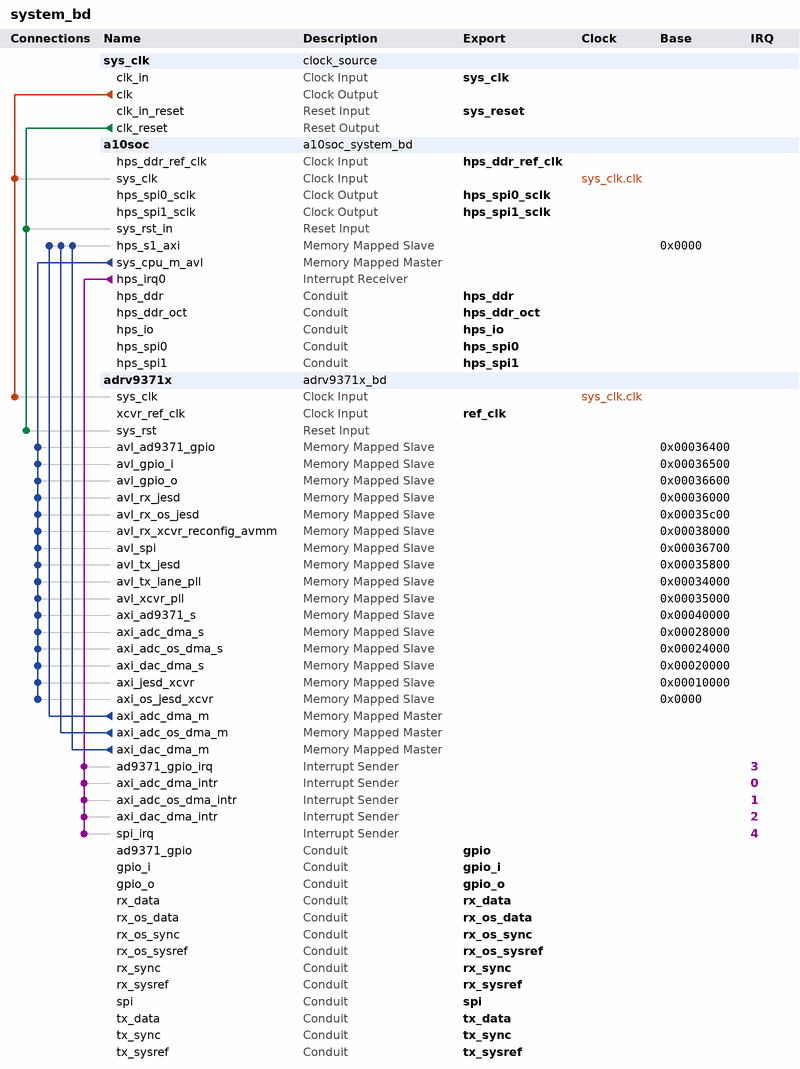
[diagram p0: system contents]
# Platform Designer (Qsys) system system_bd, Arria 10 10AS066N3F40E2SGE2
# Parameters at their usual value, and those the tool derives, are not listed.
package require -exact qsys 15.1
create_system system_bd
set_project_property DEVICE_FAMILY {Arria 10}
set_project_property DEVICE 10AS066N3F40E2SGE2

add_instance sys_clk clock_source 15.1
set_instance_parameter_value sys_clk clockFrequency 100000000

add_instance a10soc a10soc_system_bd 1.0

add_instance adrv9371x adrv9371x_bd 1.0

# connections
add_connection sys_clk.clk a10soc.sys_clk clock
add_connection sys_clk.clk adrv9371x.sys_clk clock
add_connection sys_clk.clk_reset a10soc.sys_rst_in reset
add_connection sys_clk.clk_reset adrv9371x.sys_rst reset
add_connection a10soc.sys_cpu_m_avl adrv9371x.avl_ad9371_gpio avalon
set_connection_parameter_value a10soc.sys_cpu_m_avl/adrv9371x.avl_ad9371_gpio baseAddress 0x00036400
add_connection a10soc.sys_cpu_m_avl adrv9371x.avl_gpio_i avalon
set_connection_parameter_value a10soc.sys_cpu_m_avl/adrv9371x.avl_gpio_i baseAddress 0x00036500
add_connection a10soc.sys_cpu_m_avl adrv9371x.avl_gpio_o avalon
set_connection_parameter_value a10soc.sys_cpu_m_avl/adrv9371x.avl_gpio_o baseAddress 0x00036600
add_connection a10soc.sys_cpu_m_avl adrv9371x.avl_rx_jesd avalon
set_connection_parameter_value a10soc.sys_cpu_m_avl/adrv9371x.avl_rx_jesd baseAddress 0x00036000
add_connection a10soc.sys_cpu_m_avl adrv9371x.avl_rx_os_jesd avalon
set_connection_parameter_value a10soc.sys_cpu_m_avl/adrv9371x.avl_rx_os_jesd baseAddress 0x00035c00
add_connection a10soc.sys_cpu_m_avl adrv9371x.avl_rx_xcvr_reconfig_avmm avalon
set_connection_parameter_value a10soc.sys_cpu_m_avl/adrv9371x.avl_rx_xcvr_reconfig_avmm baseAddress 0x00038000
add_connection a10soc.sys_cpu_m_avl adrv9371x.avl_spi avalon
set_connection_parameter_value a10soc.sys_cpu_m_avl/adrv9371x.avl_spi baseAddress 0x00036700
add_connection a10soc.sys_cpu_m_avl adrv9371x.avl_tx_jesd avalon
set_connection_parameter_value a10soc.sys_cpu_m_avl/adrv9371x.avl_tx_jesd baseAddress 0x00035800
add_connection a10soc.sys_cpu_m_avl adrv9371x.avl_tx_lane_pll avalon
set_connection_parameter_value a10soc.sys_cpu_m_avl/adrv9371x.avl_tx_lane_pll baseAddress 0x00034000
add_connection a10soc.sys_cpu_m_avl adrv9371x.avl_xcvr_pll avalon
set_connection_parameter_value a10soc.sys_cpu_m_avl/adrv9371x.avl_xcvr_pll baseAddress 0x00035000
add_connection a10soc.sys_cpu_m_avl adrv9371x.axi_ad9371_s avalon
set_connection_parameter_value a10soc.sys_cpu_m_avl/adrv9371x.axi_ad9371_s baseAddress 0x00040000
add_connection a10soc.sys_cpu_m_avl adrv9371x.axi_adc_dma_s avalon
set_connection_parameter_value a10soc.sys_cpu_m_avl/adrv9371x.axi_adc_dma_s baseAddress 0x00028000
add_connection a10soc.sys_cpu_m_avl adrv9371x.axi_adc_os_dma_s avalon
set_connection_parameter_value a10soc.sys_cpu_m_avl/adrv9371x.axi_adc_os_dma_s baseAddress 0x00024000
add_connection a10soc.sys_cpu_m_avl adrv9371x.axi_dac_dma_s avalon
set_connection_parameter_value a10soc.sys_cpu_m_avl/adrv9371x.axi_dac_dma_s baseAddress 0x00020000
add_connection a10soc.sys_cpu_m_avl adrv9371x.axi_jesd_xcvr avalon
set_connection_parameter_value a10soc.sys_cpu_m_avl/adrv9371x.axi_jesd_xcvr baseAddress 0x00010000
add_connection a10soc.sys_cpu_m_avl adrv9371x.axi_os_jesd_xcvr avalon
set_connection_parameter_value a10soc.sys_cpu_m_avl/adrv9371x.axi_os_jesd_xcvr baseAddress 0x0000
add_connection adrv9371x.axi_adc_dma_m a10soc.hps_s1_axi avalon
set_connection_parameter_value adrv9371x.axi_adc_dma_m/a10soc.hps_s1_axi baseAddress 0x0000
add_connection adrv9371x.axi_adc_os_dma_m a10soc.hps_s1_axi avalon
set_connection_parameter_value adrv9371x.axi_adc_os_dma_m/a10soc.hps_s1_axi baseAddress 0x0000
add_connection adrv9371x.axi_dac_dma_m a10soc.hps_s1_axi avalon
set_connection_parameter_value adrv9371x.axi_dac_dma_m/a10soc.hps_s1_axi baseAddress 0x0000
add_connection a10soc.hps_irq0 adrv9371x.ad9371_gpio_irq interrupt
set_connection_parameter_value a10soc.hps_irq0/adrv9371x.ad9371_gpio_irq irqNumber 3
add_connection a10soc.hps_irq0 adrv9371x.axi_adc_dma_intr interrupt
set_connection_parameter_value a10soc.hps_irq0/adrv9371x.axi_adc_dma_intr irqNumber 0
add_connection a10soc.hps_irq0 adrv9371x.axi_adc_os_dma_intr interrupt
set_connection_parameter_value a10soc.hps_irq0/adrv9371x.axi_adc_os_dma_intr irqNumber 1
add_connection a10soc.hps_irq0 adrv9371x.axi_dac_dma_intr interrupt
set_connection_parameter_value a10soc.hps_irq0/adrv9371x.axi_dac_dma_intr irqNumber 2
add_connection a10soc.hps_irq0 adrv9371x.spi_irq interrupt
set_connection_parameter_value a10soc.hps_irq0/adrv9371x.spi_irq irqNumber 4

# exported interfaces
add_interface gpio conduit end
set_interface_property gpio EXPORT_OF adrv9371x.ad9371_gpio
add_interface gpio_i conduit end
set_interface_property gpio_i EXPORT_OF adrv9371x.gpio_i
add_interface gpio_o conduit end
set_interface_property gpio_o EXPORT_OF adrv9371x.gpio_o
add_interface hps_ddr conduit end
set_interface_property hps_ddr EXPORT_OF a10soc.hps_ddr
add_interface hps_ddr_oct conduit end
set_interface_property hps_ddr_oct EXPORT_OF a10soc.hps_ddr_oct
add_interface hps_ddr_ref_clk clock sink
set_interface_property hps_ddr_ref_clk EXPORT_OF a10soc.hps_ddr_ref_clk
add_interface hps_io conduit end
set_interface_property hps_io EXPORT_OF a10soc.hps_io
add_interface hps_spi0 conduit end
set_interface_property hps_spi0 EXPORT_OF a10soc.hps_spi0
add_interface hps_spi0_sclk clock source
set_interface_property hps_spi0_sclk EXPORT_OF a10soc.hps_spi0_sclk
add_interface hps_spi1 conduit end
set_interface_property hps_spi1 EXPORT_OF a10soc.hps_spi1
add_interface hps_spi1_sclk clock source
set_interface_property hps_spi1_sclk EXPORT_OF a10soc.hps_spi1_sclk
add_interface ref_clk clock sink
set_interface_property ref_clk EXPORT_OF adrv9371x.xcvr_ref_clk
add_interface rx_data conduit end
set_interface_property rx_data EXPORT_OF adrv9371x.rx_data
add_interface rx_os_data conduit end
set_interface_property rx_os_data EXPORT_OF adrv9371x.rx_os_data
add_interface rx_os_sync conduit end
set_interface_property rx_os_sync EXPORT_OF adrv9371x.rx_os_sync
add_interface rx_os_sysref conduit end
set_interface_property rx_os_sysref EXPORT_OF adrv9371x.rx_os_sysref
add_interface rx_sync conduit end
set_interface_property rx_sync EXPORT_OF adrv9371x.rx_sync
add_interface rx_sysref conduit end
set_interface_property rx_sysref EXPORT_OF adrv9371x.rx_sysref
add_interface spi conduit end
set_interface_property spi EXPORT_OF adrv9371x.spi
add_interface sys_clk clock sink
set_interface_property sys_clk EXPORT_OF sys_clk.clk_in
add_interface sys_reset reset sink
set_interface_property sys_reset EXPORT_OF sys_clk.clk_in_reset
add_interface tx_data conduit end
set_interface_property tx_data EXPORT_OF adrv9371x.tx_data
add_interface tx_sync conduit end
set_interface_property tx_sync EXPORT_OF adrv9371x.tx_sync
add_interface tx_sysref conduit end
set_interface_property tx_sysref EXPORT_OF adrv9371x.tx_sysref

set_interconnect_requirement {$system} qsys_mm.clockCrossingAdapter FIFO
set_interconnect_requirement {$system} qsys_mm.insertDefaultSlave false
set_interconnect_requirement {$system} qsys_mm.maxAdditionalLatency 2

save_system system_bd.qsys
